# Altium schematic sheet Connector.SchDoc
size A4
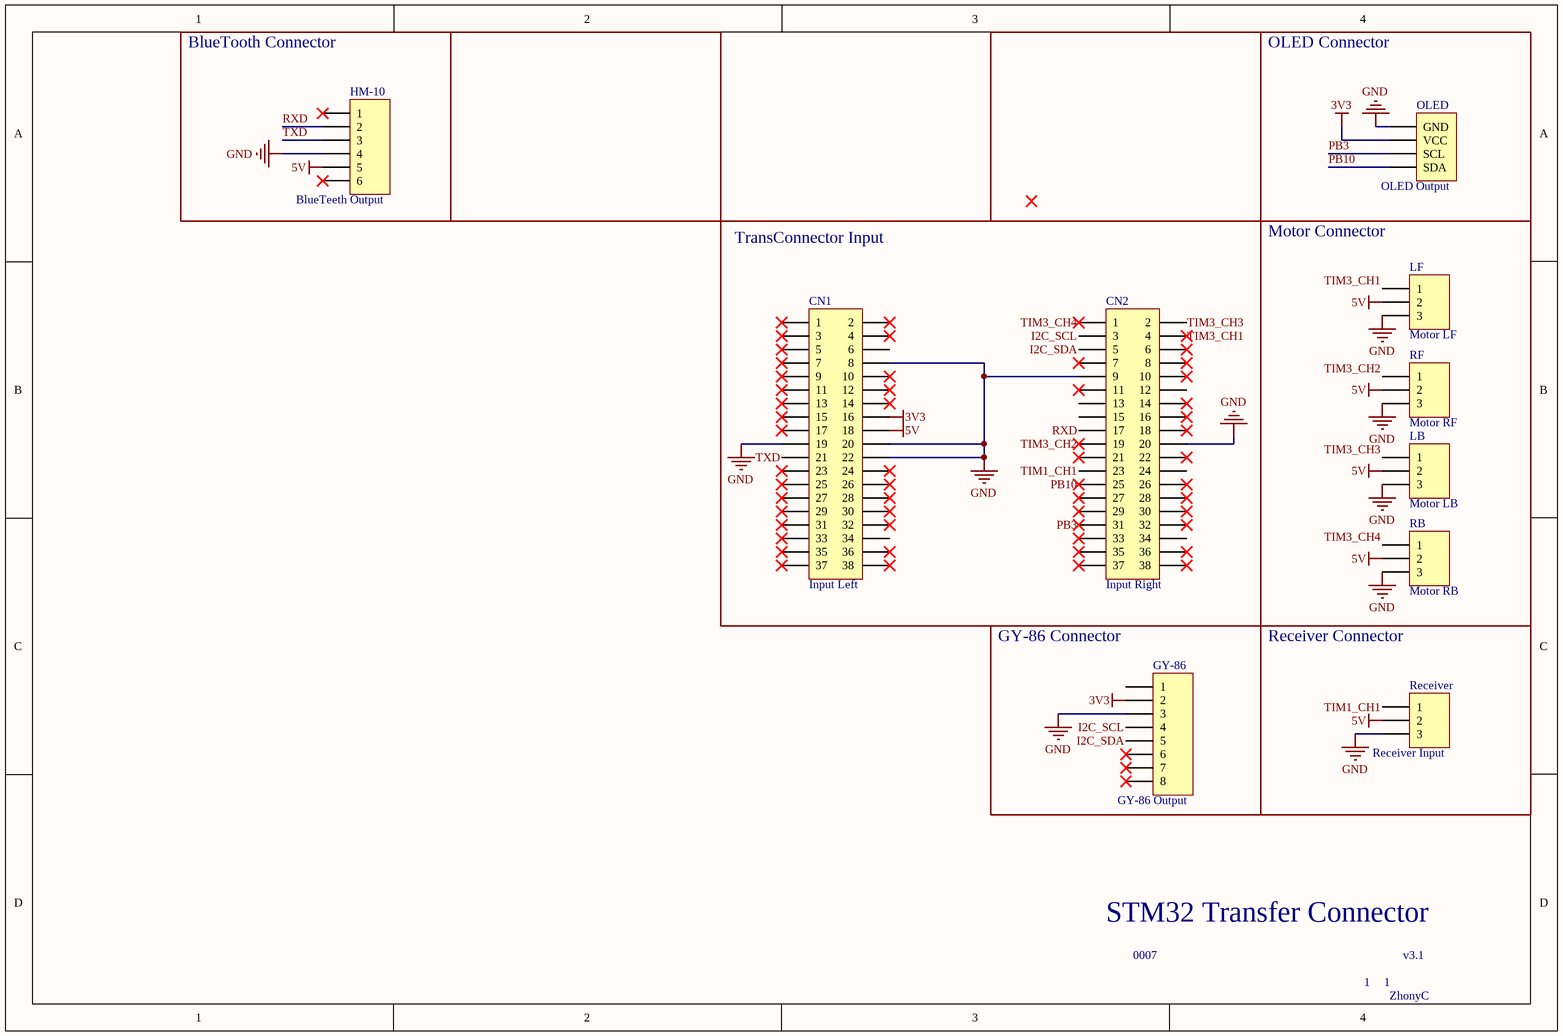
[diagram p0: Connector.SchDoc]

## Parts
CN1  Input Left  [2*19P]
CN2  Input Right  [2*19P]
GY-86  GY-86 Output  [HDR1X8]
HM-10  BlueTeeth Output  [HDR1X6]
LB  Motor LB  [HDR1X3]
LF  Motor LF  [HDR1X3]
OLED  OLED Output  [HDR1X4]
RB  Motor RB  [HDR1X3]
Receiver  Receiver Input  [HDR1X3]
RF  Motor RF  [HDR1X3]

## Blocks framed on the sheet
BlueTooth Connector: HM-10
OLED Connector: OLED
TransConnector Input: CN1 CN2
Motor Connector: LB LF RB RF
GY-86 Connector: GY-86
Receiver Connector: Receiver

## Nets
3V3: CN1.16 GY-86.2 OLED.2(VCC)
5V: CN1.18 HM-10.5 LB.2 LF.2 RB.2 Receiver.2 RF.2
GND: CN1.8 CN1.19 CN1.20 CN1.22 CN2.9 CN2.20 GY-86.3 HM-10.4 LB.3 LF.3 OLED.1(GND) RB.3 Receiver.3 RF.3
I2C_SCL: CN2.3 GY-86.4
I2C_SDA: CN2.5 GY-86.5
PB3: CN2.31 OLED.3(SCL)
PB10: CN2.25 OLED.4(SDA)
RXD: CN2.17 HM-10.2
TIM1_CH1: CN2.23 Receiver.1
TIM3_CH1: CN2.4 LF.1
TIM3_CH2: CN2.19 RF.1
TIM3_CH3: CN2.2 LB.1
TIM3_CH4: CN2.1 RB.1
TXD: CN1.21 HM-10.3

Not connected (* = marked no-connect by the designer): CN1 1* 2* 3* 4* 5* 6 7* 9* 10* 11* 12* 13* 14* 15* 17* 23* 24* 25* 26* 27* 28* 29* 30* 31* 32* 33* 34 35* 36* 37* 38*; CN2 6* 7* 8* 10* 11* 12 13 14* 15 16* 18* 21* 22* 24 26* 27* 28* 29* 30* 32* 33* 34 35* 36* 37* 38*; GY-86 1 6* 7* 8*; HM-10 1* 6*

## Notes on the sheet
- STM32 Transfer Connector
- 0007
- 1
- v3.1
- ZhonyC

## Library data of the parts
CN1 CN2 = Header 19X2: Header, 19-Pin, Dual row; LatestRevisionDate: 17-Jul-2002; LatestRevisionNote: Re-released for DXP Platform.; Publisher: Altium Limited
GY-86 = Header 8: Header, 8-Pin; LatestRevisionDate: 17-Jul-2002; LatestRevisionNote: Re-released for DXP Platform.; Publisher: Altium Limited
HM-10 = Header 6: Header, 6-Pin; LatestRevisionDate: 17-Jul-2002; LatestRevisionNote: Re-released for DXP Platform.; Publisher: Altium Limited
LB LF RB Receiver RF = Header 3: Header, 3-Pin; LatestRevisionDate: 17-Jul-2002; LatestRevisionNote: Re-released for DXP Platform.; Publisher: Altium Limited
OLED = Header 4: Header, 4-Pin; LatestRevisionDate: 17-Jul-2002; LatestRevisionNote: Re-released for DXP Platform.; Publisher: Altium Limited